# EAGLE design Raspi Power (EAGLE 8.2.1)
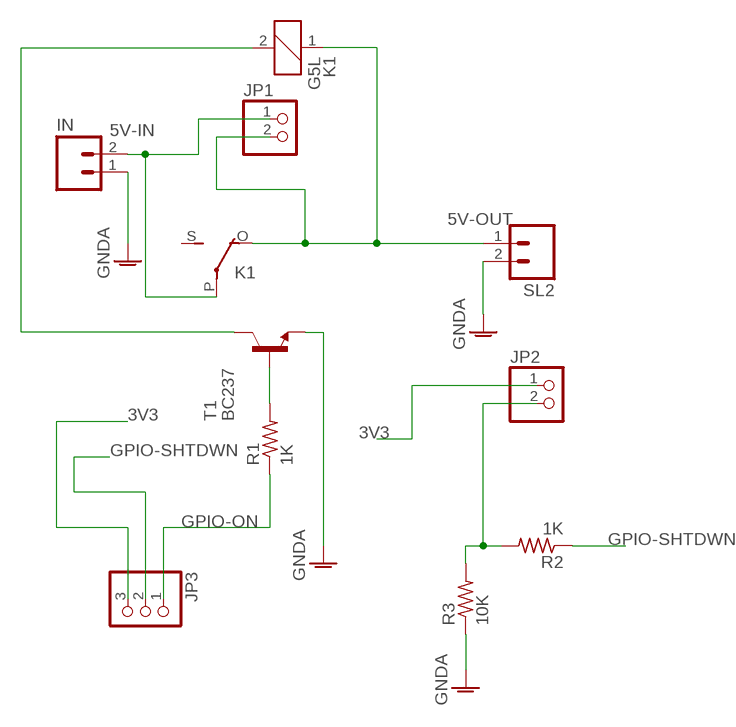
[diagram p0: schematic, sheet 1]

## Parts
IN  M02  [02P]
JP1  PINHD-1X2  [1X02]
JP2  PINHD-1X2  [1X02]
JP3  PINHD-1X3  [1X03]
K1  G5L  [G5LE]
R1  1K  R-US_0204/7  [0204/7]
R2  1K  R-US_0204/7  [0204/7]
R3  10K  R-US_0204/7  [0204/7]
SL2  M02  [02P]
T1  BC237  [TO92]

## Nets
3V3: JP2.1 JP3.3
5V-IN [5v]: IN.2 JP1.1 K1.P(2:P)
5V-OUT [5v]: JP1.2 K1.1 K1.O(2:O) SL2.1
B: R1.2 T1.2(B)
GNDA [ground]: IN.1 R3.1 SL2.2 T1.1(E)
GPIO-ON: JP3.1 R1.1
GPIO-SHTDWN: JP3.2 R2.1
N$1: K1.2 T1.3(C)
N$5: JP2.2 R2.2 R3.2
Unconnected: K1.S(2:S)

## Library data of the parts
IN SL2 = con-amp-quick:M02: AMP QUICK CONNECTOR; OC_FARNELL: unknown; OC_NEWARK: unknown
JP1 JP2 = pinhead:PINHD-1X2: PIN HEADER
JP3 = pinhead:PINHD-1X3: PIN HEADER
K1 = relay:G5L: RELAY 1 x switch, 10 A/120 V AC, 8 A/30 V ADC, Omron; OC_FARNELL: unknown; OC_NEWARK: unknown
R1-R3 = resistor:R-US_: RESISTOR, American symbol
T1 = transistor:BC237: NPN TRANSISTOR

## Net classes
0 default: width 0.813 mm, drill 0.61 mm
1 ground: width 1.27 mm, drill 1.27 mm
2 5v: width 1.27 mm, drill 1.27 mm
3 signal: width 0.813 mm, drill 0.61 mm, clearance 0.61 mm

## Board
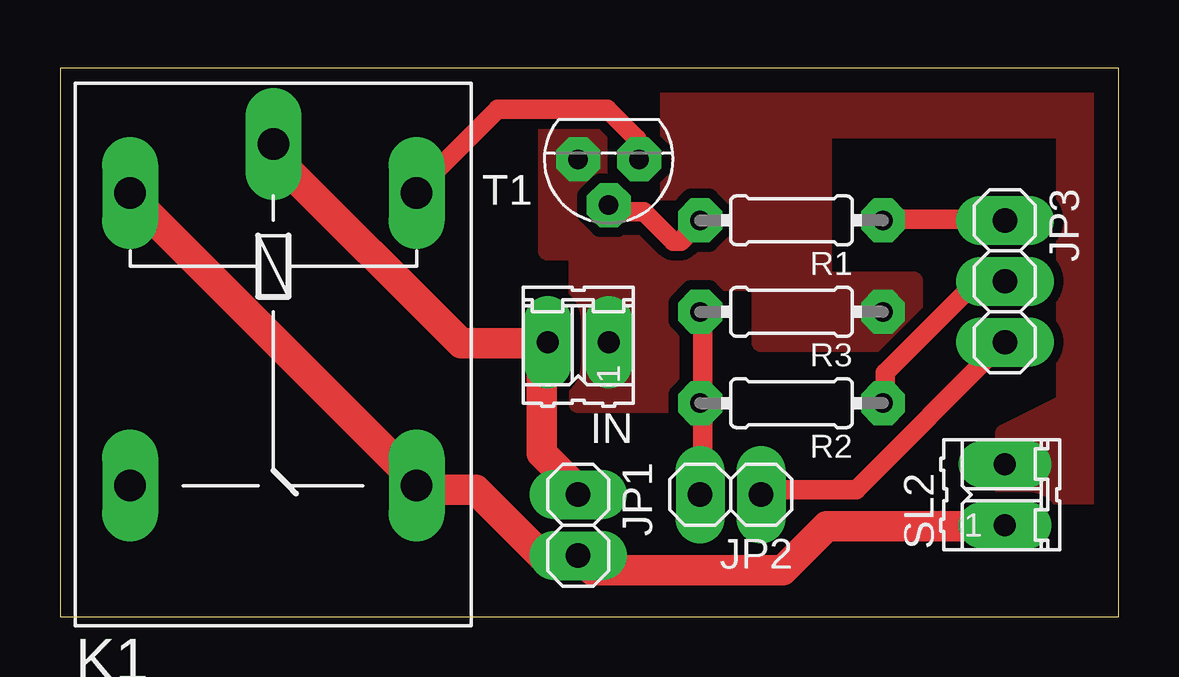
[diagram p1: board, top side]

Size 44.12 x 22.85 mm. Coordinates in mm from the lower left corner, seen from the top.
Outline: 0,0 44.12,0 44.12,22.85 0,22.85 0,0
Copper layers (1*16): Top 0.035mm / dielectric 1.5mm / Bottom 0.035mm
Design rules "default *": minimum track width 16mil, minimum drill 24mil, track to track 16mil, track to pad 16mil, pad to pad 16mil, via to via 16mil, smd to smd 8mil, copper to edge 40mil, drill to drill 16mil, minimum pad ring 20mil, minimum via ring 16mil, stop-mask expansion 8mil, vias tented up to drill 0mil, thermal gap 10mil

### Footprints (pad centres in the part's own frame; a part is rotated, then mirrored left to right if it is on the bottom)
02P = drill 0.914 long: 1 -1.27,0; 2 1.27,0
1X02 = drill 1.016 long: 1 -1.27,0; 2 1.27,0
1X03 = drill 1.016 long: 1 -2.54,0; 2 0,0; 3 2.54,0
G5LE = drill 1.321 long: 1 -7.493,-5.969; 2 -7.493,5.969; O 4.699,5.969; P -9.525,0; S 4.699,-5.969
0204/7 = drill 0.813 octagon: 1 -3.81,0; 2 3.81,0
TO92 = drill 0.813 octagon: 1 1.27,0; 2 0,1.905; 3 -1.27,0

### Placement (x,y rotation side)
IN  21.59,11.43 180 top
JP1  21.59,3.81 270 top
JP2  27.94,5.08 180 top
JP3  39.37,13.97 270 top
K1  8.89,10.16 270 top
R1  30.48,16.51 180 top
R2  30.48,8.89 180 top
R3  30.48,12.7 180 top
SL2  39.37,5.08 90 top
T1  22.86,19.05 180 top

### Tracks (layer width: path | path; a pad name or v marks a point on that pad's centre or on a via)
3V3
  Top 0.813: JP2.1 29.21,5.28 33.17,5.28 39.27,11.38 JP3.3
5V-IN
  Top 1.27: JP1.1 21.59,5.28 20.07,6.81 20.07,11.38 IN.2 19.46,11.38 16.71,11.38 9.09,19 9.09,19.61 K1.P
5V-OUT
  Top 1.27: SL2.1 39.27,3.76 31.95,3.76 30.12,1.93 22.2,1.93 JP1.2 20.07,2.54 17.32,5.28 14.88,5.28 K1.O 14.58,5.89 3,17.48 K1.1
B
  Top 0.813: T1.2 23.11,16.87 24.33,16.87 25.55,15.65 25.86,15.65 26.16,15.95 26.16,16.56 26.47,16.56 R1.2
GNDA
  pour Top (no thermals): 44.45,22.86 25.4,22.86 25.4,17.78 24.13,16.51 22.86,16.51 22.86,20.32 20.32,20.32 20.32,15.24 21.59,15.24 21.59,8.89 25.4,8.89 25.4,13.97 29.21,13.97 29.21,11.43 35.56,11.43 35.56,13.97 31.75,13.97 31.75,20.32 41.91,20.32 41.91,8.89 39.37,7.62 39.37,5.08 44.45,5.08
GPIO-ON
  Top 0.813: R1.1 34.39,16.56 39.27,16.56 JP3.1
GPIO-SHTDWN
  Top 0.813: R2.1 34.39,8.94 34.39,10.16 38.05,13.82 39.27,13.82 JP3.2
N$1
  Top 0.813: T1.3 24.03,19.3 24.03,19.91 22.81,21.13 18.24,21.13 14.88,17.78 K1.2
N$5
  Top 0.813: JP2.2 26.77,5.28 26.77,8.64 R2.2 26.77,9.25 26.77,12.6 R3.2